# Altium schematic sheet Power.SchDoc
size A; SheetNumber: 2; SheetTotal: 6
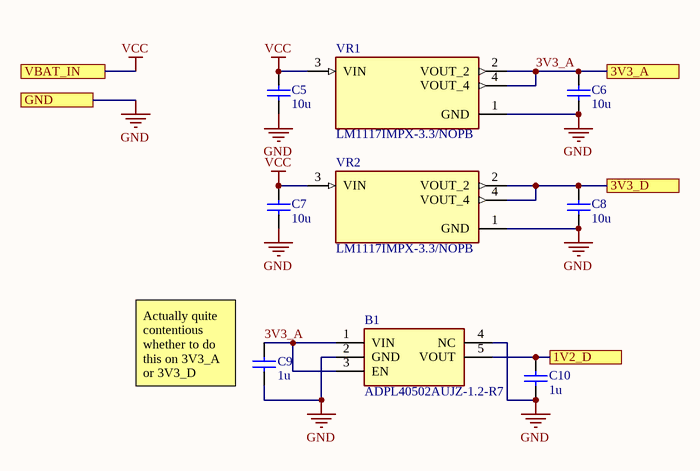
[diagram p0: Power.SchDoc]

## Parts
B1  ADPL40502AUJZ-1.2-R7  [SOT95P280X100-5N]
C5  value 10u  (hidden comment: Capacitor)
C6  value 10u  (hidden comment: Capacitor)
C7  value 10u  (hidden comment: Capacitor)
C8  value 10u  (hidden comment: Capacitor)
C9  value 1u  (hidden comment: Capacitor)
C10  value 1u  (hidden comment: Capacitor)
VR1  LM1117IMPX-3.3/NOPB  [VREG_LM1117IMPX-3.3/NOPB]
VR2  LM1117IMPX-3.3/NOPB  [VREG_LM1117IMPX-3.3/NOPB]

## Ports
1V2_D, 3V3_A, 3V3_D, GND, VBAT_IN

## Nets
GND: B1.2(GND) B1.4(NC) C5.1 C6.1 C7.1 C8.1 C9.1 C10.1 VR1.1(GND) VR2.1(GND) ; port GND
VCC: C5.2 C7.2 VR1.3(VIN) VR2.3(VIN) ; port VBAT_IN
1V2_D: B1.5(VOUT) C10.2 ; port 1V2_D
3V3_A: B1.1(VIN) B1.3(EN) C6.2 C9.2 VR1.2(VOUT_2) VR1.4(VOUT_4) ; port 3V3_A
3V3_D: C8.2 VR2.2(VOUT_2) VR2.4(VOUT_4) ; port 3V3_D

## Notes on the sheet
- (near C9) Actually quite contentious whether to do this on 3V3_A or 3V3_D

## Library data of the parts
B1 = ADPL40502AUJZ-1.2-R7: Low Noise, 200mA, CMOS Linear Regulator; Manufacturer_Name: Analog Devices; Geometry.Height: 1mm; Mouser Part Number: *; Mouser Price/Stock: *; Manufacturer_Part_Number: ADPL40502AUJZ-1.2-R7; Datasheet Link: https://www.analog.com/ADPL40502/datasheet
C5-C10 = Capacitor: SimulationGenericComponent: True
VR1 VR2 = LM1117IMPX-3.3/NOPB: 800-mA 15-V linear voltage regulator; MF: Texas Instruments; SnapEDA_Link: https://www.snapeda.com/parts/LM1117IMPX-3.3/NOPB/Texas+Instruments/view-part/?ref=snap; Package: SOT-223-4 Texas Instruments; Value: *; MP: LM1117IMPX-3.3/NOPB; Check_prices: https://www.snapeda.com/parts/LM1117IMPX-3.3/NOPB/Texas+Instruments/view-part/?ref=eda